# EAGLE design v11 (EAGLE 8.4.1)
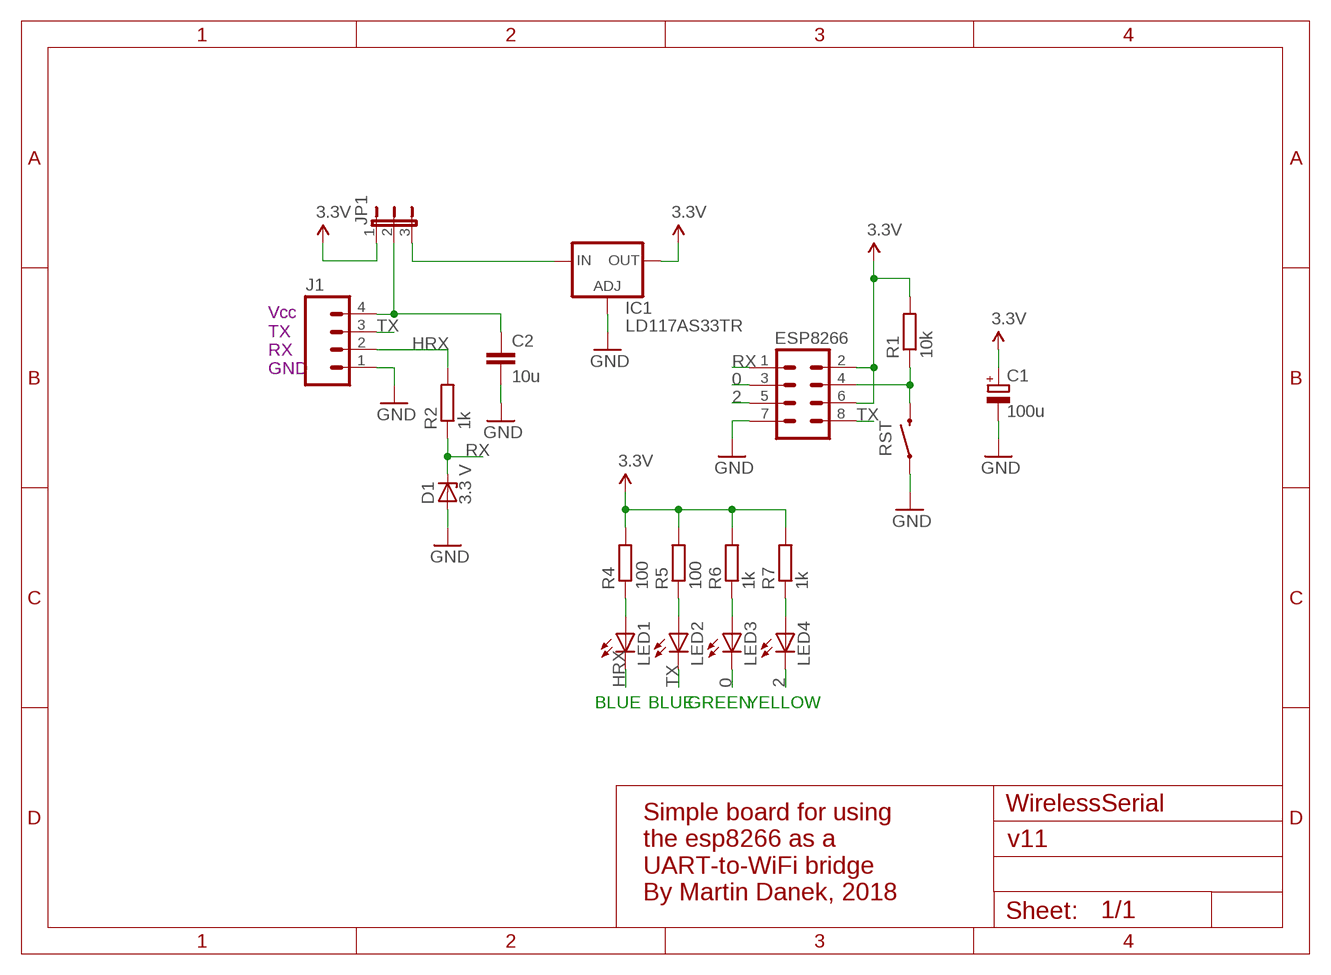
[diagram p0: schematic, sheet 1]

## Parts
C1  100u  CPOL-EUE2,5-6E  [E2,5-6E]
C2  10u  C-EUC1206  [C1206]
D1  3.3 V  ZENER-DIODEDO35Z10  [DO35Z10]
ESP8266  M04X2  [2X4]
IC1  LD117AS33TR  [SOT223]
J1  M04LONGPADS  [1X04_LONGPADS]
JP1  JP2E  [JP2]
LED1  LEDSML1206  [SML1206]
LED2  LEDSML1206  [SML1206]
LED3  LEDSML1206  [SML1206]
LED4  LEDSML1206  [SML1206]
R1  10k  R-EU_R1206  [R1206]
R2  1k  R-EU_R1206  [R1206]
R4  100  R-EU_R1206  [R1206]
R5  100  R-EU_R1206  [R1206]
R6  1k  R-EU_R1206  [R1206]
R7  1k  R-EU_R1206  [R1206]
RST  SWITCH-MOMENTARY-2PTH  [TACTILE-PTH]

## Nets
0: ESP8266.3 LED3.C
2: ESP8266.5 LED4.C
3.3V: C1.+ ESP8266.2 ESP8266.6 IC1.4(OUT) JP1.1 R1.2 R4.2 R5.2 R6.2 R7.2
GND: C1.- C2.2 D1.A ESP8266.7 IC1.1(ADJ) J1.1 RST.1
HRX: J1.2 LED1.C R2.2
N$1: C2.1 J1.4 JP1.2
N$2: ESP8266.4 R1.1 RST.3
N$4: IC1.3(IN) JP1.3
N$8: LED1.A R4.1
N$9: LED2.A R5.1
N$10: LED3.A R6.1
N$11: LED4.A R7.1
RX: D1.C ESP8266.1 R2.1
TX: ESP8266.8 J1.3 LED2.C

## Notes on the sheet
- Vcc
  TX
  RX
  GND
- BLUE | BLUE | GREEN | YELLOW
- WirelessSerial
- Simple board for using
  the esp8266 as a 
  UART-to-WiFi bridge
  By Martin Danek, 2018

## Library data of the parts
C1 = resistor:CPOL-EU: POLARIZED CAPACITOR, European symbol
C2 = resistor:C-EU: CAPACITOR, European symbol
D1 = diode:ZENER-DIODE: Z-Diode
ESP8266 = SparkFun-Connectors:M04X2: .1" header, two rows of four.
IC1 = v-reg:LD117A?*: Low drop fixed and adjustable positive voltage regulators 1 A Source: http://www.st.com/stonline/products/literature/ds/7194/ld1117axx.pdf
J1 = SparkFun-Connectors:M04: Header 4 Standard 4-pin 0.1" header. Use with straight break away headers (SKU : PRT-00116), right angle break away headers (PRT-00553), swiss pins (PRT-00743), machine pins (PRT-00117), and female headers (PRT-00115). Molex polarized connector foot print use with SKU : PRT-08231 with associated crimp pins and housings. 1MM SMD Version SKU: PRT-10208; PROD_ID: CONN-09696
JP1 = jumper:JP2E: JUMPER
LED1-LED4 = led:LED: LED OSRAM: - CHIPLED LG R971, LG N971, LY N971, LG Q971, LY Q971, LO R971, LY R971 LH N974, LH R974 LS Q976, LO Q976, LY Q976 LO Q996 - Hyper CHIPLED LW Q18S LB Q993, LB Q99A, LB R99A - SideLED LS A670, LO A670, LY A670, LG A670, LP A670 LB A673, LV A673, LT A673, LW A673 LH A674 LY A675 LS A676, LA A676, LO A676, LY A676, LW A676 LS A679, LY A679, LG A679 - Hyper Micro SIDELED® LS Y876, LA Y876, LO Y876, LY Y876 LT Y87S - SmartLED LW L88C, LW L88S LB L89C, LB L89S, LG L890 LS L89K, LO L89K, LY L89K LS L896, LA L896, LO L896, LY L896 - TOPLED LS T670, LO T670, LY T670, LG T670, LP T670 LSG T670, LSP T670, LSY T670, LOP T670, LYG T670 LG T671, LOG T671, LSG T671 LB T673, LV T673, LT T673, LW T673 LH T674 LS T676, LA T676, LO T676, LY T676, LB T676, LH T676, LSB T676, LW T676 LB T67C, LV T67C, LT T67C, LS T67K, LO T67K, LY T67K, LW E67C LS E67B, LA E67B, LO E67B, LY E67B, LB E67C, LV E67C, LT E67C LW T67C LS T679, LY T679, LG T679 LS T770, LO T770, LY T770, LG T770, LP T770 LB T773, LV T773, LT T773, LW T773 LH T774 LS E675, LA E675, LY E675, LS T675 LS T776, LA T776, LO T776, LY T776, LB T776 LHGB T686 LT T68C, LB T68C - Hyper Mini TOPLED® LB M676 - Mini TOPLED Santana® LG M470 LS M47K, LO M47K, LY M47K Source: http://www.osram.convergy.de LUXEON: - LUMILED® LXK2-PW12-R00, LXK2-PW12-S00, LXK2-PW14-U00, LXK2-PW14-V00 LXK2-PM12-R00, LXK2-PM12-S00, LXK2-PM14-U00 LXK2-PE12-Q00, LXK2-PE12-R00, LXK2-PE12-S00, LXK2-PE14-T00, LXK2-PE14-U00 LXK2-PB12-K00, LXK2-PB12-L00, LXK2-PB12-M00, LXK2-PB14-N00, LXK2-PB14-P00, LXK2-PB14-Q00 LXK2-PR12-L00, LXK2-PR12-M00, LXK2-PR14-Q00, LXK2-PR14-R00 LXK2-PD12-Q00, LXK2-PD12-R00, LXK2-PD12-S00 LXK2-PH12-R00, LXK2-PH12-S00 LXK2-PL12-P00, LXK2-PL12-Q00, LXK2-PL12-R00 Source: www.luxeon.com KINGBRIGHT: KA-3528ASYC Source: www.kingbright.com
R1 R2 R4-R7 = resistor:R-EU_: RESISTOR, European symbol
RST = SparkFun-Electromechanical:SWITCH-MOMENTARY-2: Various NO switches- pushbuttons, reed, etc; PROD_ID: SWCH-08441

## Board
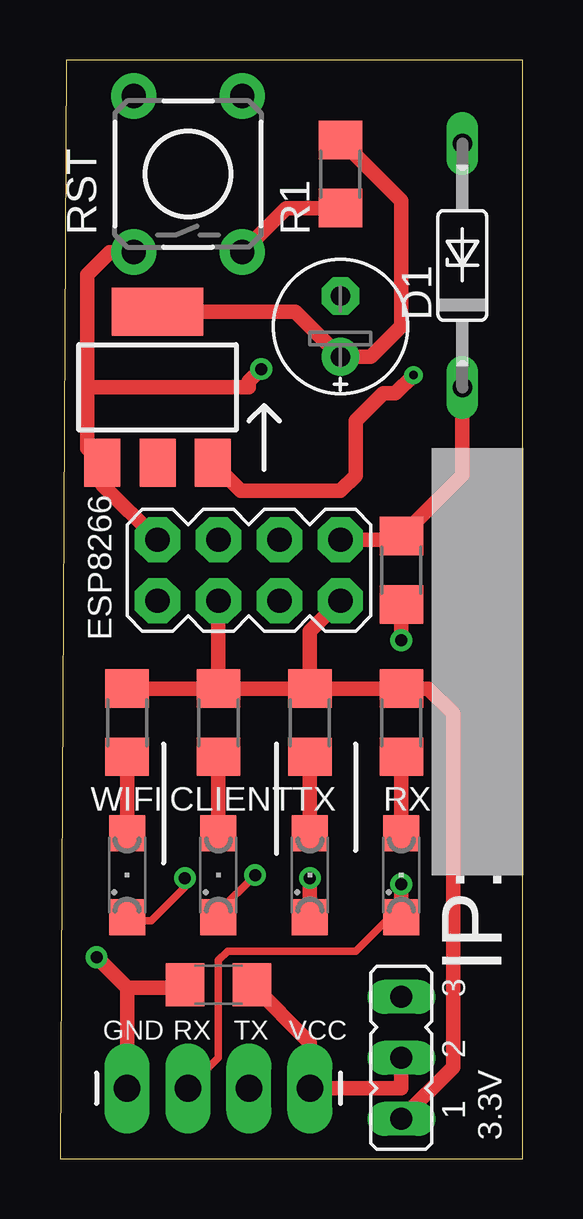
[diagram p1: board, top side]
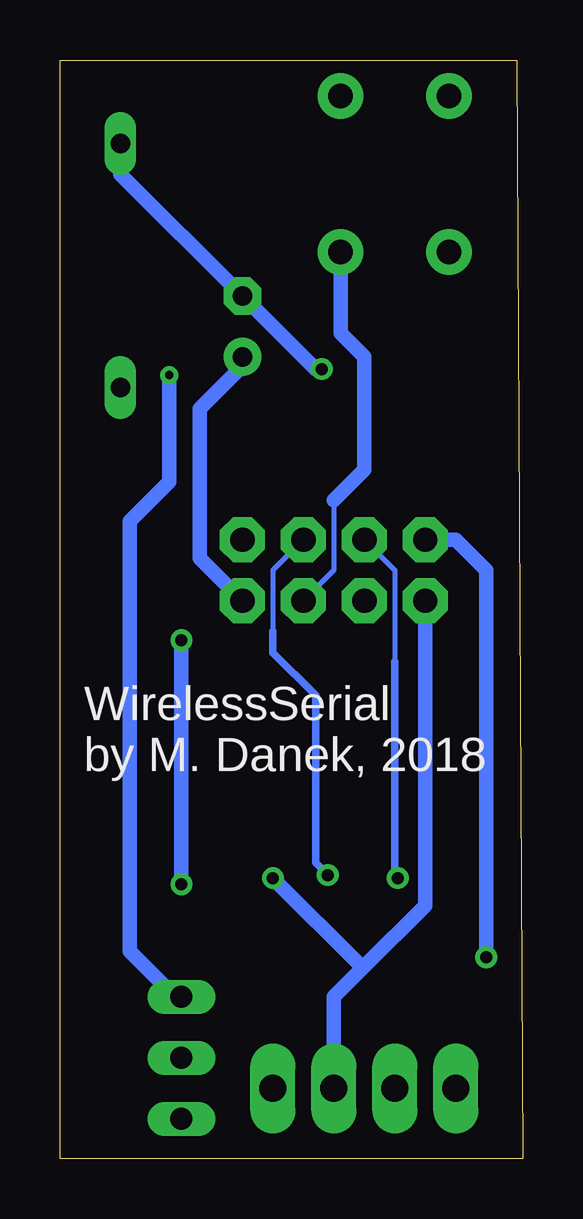
[diagram p2: board, bottom side, seen from below]

Size 19.28 x 45.77 mm. Coordinates in mm from the lower left corner, seen from the top.
Outline: 0,0 19.28,0 19.28,45.77 0.25,45.77 0,0
Copper layers (1*16): Top 0.035mm / dielectric 1.5mm / Bottom 0.035mm
Design rules "default": minimum track width 6mil, minimum drill 0.35mm, track to track 6mil, track to pad 6mil, pad to pad 6mil, via to via 6mil, smd to smd 6mil, copper to edge 40mil, drill to drill 6mil, minimum pad ring 10mil, minimum via ring 8mil, stop-mask expansion 4mil, vias tented up to drill 0mil, thermal gap 10mil

### Footprints (pad centres in the part's own frame; a part is rotated, then mirrored left to right if it is on the bottom)
E2,5-6E = drill 0.813 pad 1.575: + -1.27,0 | drill 0.813 pad 1.575 octagon: - 1.27,0
C1206 = smd 1.6 x 1.8: 1 -1.4,0; 2 1.4,0
DO35Z10 = drill 0.813 long: A 5.08,0; C -5.08,0
2X4 = drill 1.016 pad 1.88 octagon: 1 -3.81,-1.27; 2 -3.81,1.27; 3 -1.27,-1.27; 4 -1.27,1.27; 5 1.27,-1.27; 6 1.27,1.27; 7 3.81,-1.27; 8 3.81,1.27
SOT223 = smd 1.5 x 2: 1 -2.3,-3.15; 2 0,-3.15; 3 2.3,-3.15 | smd 3.8 x 2: 4 0,3.15
1X04_LONGPADS = drill 1.118 pad 1.88 long: 1 0,0; 2 2.54,0; 3 5.08,0; 4 7.62,0
JP2 = drill 0.914 long: 1 -2.54,0; 2 0,0; 3 2.54,0
SML1206 = smd 1.5 x 1.5: A 1.75,0; C -1.75,0
R1206 = smd 1.6 x 1.803: 1 -1.422,0; 2 1.422,0
TACTILE-PTH = drill 1.016 pad 1.88: 1 -3.251,2.261; 2 3.251,2.261; 3 -3.251,-2.261; 4 3.251,-2.261

### Placement (x,y rotation side)
C1  11.68,34.67 90 top
C2  6.6,7.24 180 top
D1  16.76,37.21 90 top
ESP8266  7.87,24.51 180 top
IC1  4.06,32.13 0 top
J1  2.79,2.92 0 top
JP1  14.22,4.19 90 top
LED1  14.22,11.81 90 top
LED2  10.41,11.81 90 top
LED3  6.6,11.81 90 top
LED4  2.79,11.81 90 top
R1  11.68,41.02 90 top
R2  14.22,24.51 270 top
R4  14.22,18.16 90 top
R5  10.41,18.16 90 top
R6  6.6,18.16 90 top
R7  2.79,18.16 90 top
RST  5.33,41.02 90 top

### Tracks (layer width: path | path; a pad name or v marks a point on that pad's centre or on a via)
0  (via drill 0.5)
  Top 0.305: v8.13,11.81 6.6,10.29 LED3.C
  Bottom 0.203: ESP8266.3 10.41,24.51 10.41,21.97
  Bottom 0.305: 10.41,21.97 10.41,21.08 8.64,19.3 8.64,12.32 v8.13,11.81
2  (via drill 0.5)
  Top 0.305: v5.21,11.68 5.21,11.3 3.81,9.91 2.95,9.91 LED4.C
  Bottom 0.203: ESP8266.5 5.33,24.51 5.33,20.7
  Bottom 0.305: 5.33,20.7 5.33,11.81 v5.21,11.68
3.3V
  Top 0.61: IC1.4 9.8,35.28 C1.+ 12.95,33.4 14.22,34.67 14.22,39.9 R1.2 | R6.2 R7.2 | R5.2 R6.2 | R5.2 R4.2 15.34,19.58 16.38,18.54 16.38,3.81 JP1.1 | ESP8266.6 R6.2 | ESP8266.2 10.41,21.97 R5.2
  Bottom 0.61: ESP8266.2 13.46,25.02 13.46,31.24 11.68,33.02 C1.+
GND  (via drill 0.5)
  Top 0.61: RST.1 2.08,37.77 1.14,36.83 1.14,32.13 | 1.14,32.13 1.14,29.6 IC1.1 1.76,28.08 ESP8266.7 | 1.14,32.13 7.87,32.13 7.87,32.38 v8.38,32.89 | v1.52,8.38 2.79,7.11 | J1.1 2.79,7.11 | 2.79,7.11 5.08,7.11 C2.2
  Bottom 0.61: v8.38,32.89 8.64,32.89 C1.- 16.76,41.02 D1.A | v1.52,8.38 1.52,24.51 2.79,25.78 ESP8266.7
HRX  (via drill 0.5)
  Top 0.305: J1.2 6.6,4.19 6.6,8.26 6.98,8.64 12.32,8.64 13.74,10.06 LED1.C
  Top 0.61: R2.2 v14.22,21.59 | LED1.C v14.22,11.43
  Bottom 0.61: v14.22,21.59 v14.22,11.43
N$1
  Top 0.61: JP1.2 14.22,2.92 J1.4 10.41,4.83 C2.1
N$2
  Top 0.61: RST.3 9.42,39.6 R1.1
  Bottom 0.203: 7.87,27.43 7.87,24.51 ESP8266.4
  Bottom 0.61: RST.3 7.59,34.39 6.6,33.4 6.6,28.7 7.87,27.43
N$4  (via drill 0.35)
  Top 0.61: IC1.3 7.53,27.81 11.68,27.81 12.32,28.45 12.32,30.73 13.46,31.88 13.97,31.88 v14.73,32.64
  Bottom 0.61: JP1.3 14.48,6.73 16.38,8.64 16.38,26.54 14.73,28.19 v14.73,32.64
N$8
  Top 0.61: R4.1 LED1.A
N$9
  Top 0.61: R5.1 LED2.A
N$10
  Top 0.61: R6.1 LED3.A
N$11
  Top 0.61: R7.1 LED4.A
RX
  Top 0.61: ESP8266.1 14.07,25.78 R2.1 | R2.1 13.74,26.42 | R2.1 16.76,28.47 D1.C
TX  (via drill 0.5)
  Top 0.61: v10.41,11.68 LED2.C
  Bottom 0.61: ESP8266.8 4.06,10.54 6.6,8 | 6.6,8 7.87,6.73 J1.3 | 6.6,8 6.73,8 v10.41,11.68

### Text on the board
tNames: ESP8266 | WIFI | CLIENT | TX | RX | IP: | GND | RX | TX | VCC | 3.3V
bNames: WirelessSerial / by M. Danek, 2018